# EAGLE schematic Schematic (EAGLE 7.7.0)
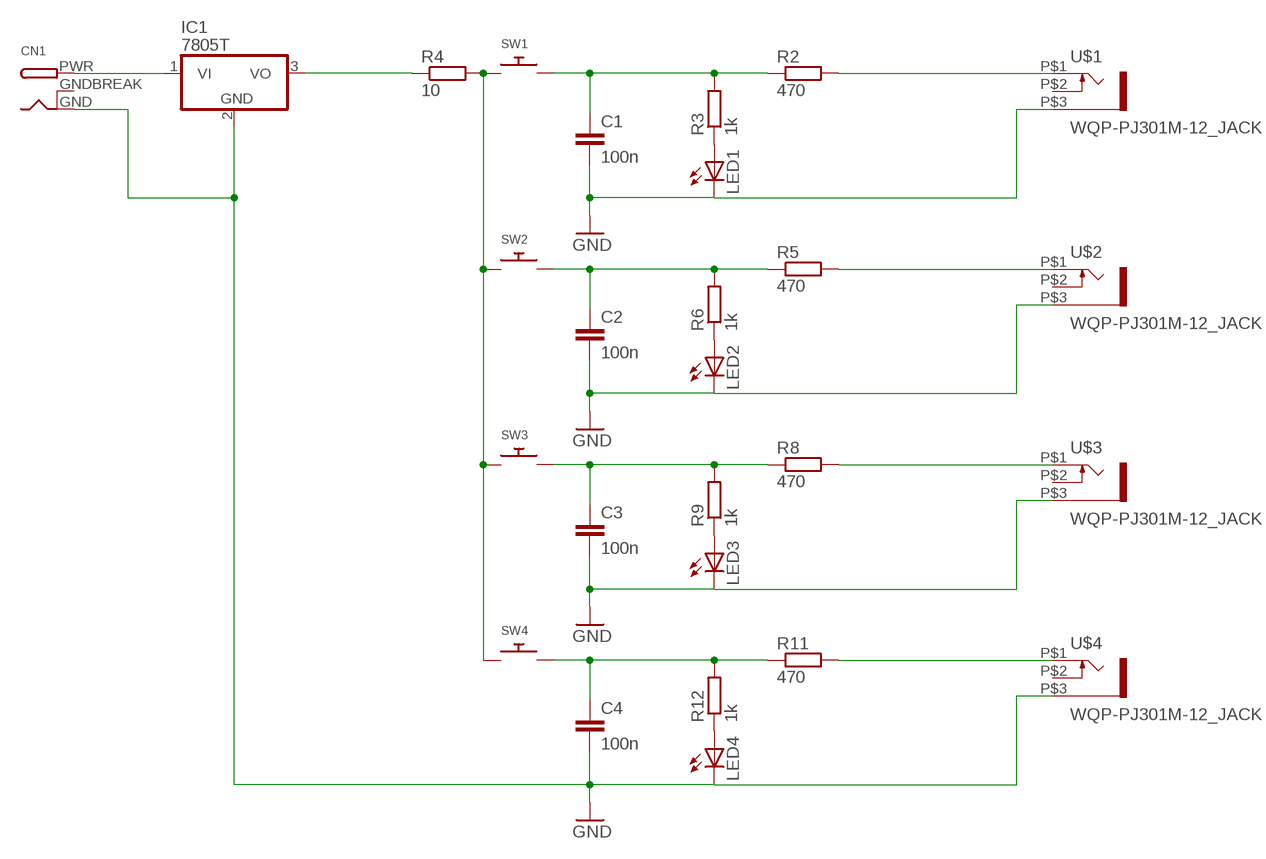
[diagram p0: schematic, sheet 1]

## Parts
C1  100n  C-EU025-025X050  [C025-025X050]
C2  100n  C-EU025-025X050  [C025-025X050]
C3  100n  C-EU025-025X050  [C025-025X050]
C4  100n  C-EU025-025X050  [C025-025X050]
CN1  DCBARRELPTH  [DCJACK_2MM_PTH]
IC1  7805T  [TO220H]
LED1  LED5MM  [LED5MM]
LED2  LED5MM  [LED5MM]
LED3  LED5MM  [LED5MM]
LED4  LED5MM  [LED5MM]
R2  470  R-EU_0204/7  [0204/7]
R3  1k  R-EU_0204/7  [0204/7]
R4  10  R-EU_0204/7  [0204/7]
R5  470  R-EU_0204/7  [0204/7]
R6  1k  R-EU_0204/7  [0204/7]
R8  470  R-EU_0204/7  [0204/7]
R9  1k  R-EU_0204/7  [0204/7]
R11  470  R-EU_0204/7  [0204/7]
R12  1k  R-EU_0204/7  [0204/7]
SW1  SWITCH_PUSHBUTTONEVQ-PE  [TACT_PANA-EVQ]
SW2  SWITCH_PUSHBUTTONEVQ-PE  [TACT_PANA-EVQ]
SW3  SWITCH_PUSHBUTTONEVQ-PE  [TACT_PANA-EVQ]
SW4  SWITCH_PUSHBUTTONEVQ-PE  [TACT_PANA-EVQ]
U$1  WQP-PJ301M-12_JACK  [WQP-PJ301M-12_JACK]
U$2  WQP-PJ301M-12_JACK  [WQP-PJ301M-12_JACK]
U$3  WQP-PJ301M-12_JACK  [WQP-PJ301M-12_JACK]
U$4  WQP-PJ301M-12_JACK  [WQP-PJ301M-12_JACK]

## Nets
GND: C1.2 C2.2 C3.2 C4.2 CN1.GND IC1.2(GND) LED1.K(C) LED2.K(C) LED3.K(C) LED4.K(C) U$1.P$3 U$2.P$3 U$3.P$3 U$4.P$3
N$1: LED1.A R3.1
N$2: IC1.3(VO) R4.1
N$3: C1.1 R2.1 R3.2 SW1.P$2
N$4: R4.2 SW1.P$1 SW2.P$1 SW3.P$1 SW4.P$1
N$5: R2.2 U$1.P$1
N$6: CN1.PWR IC1.1(VI)
N$9: C2.1 R5.1 R6.2 SW2.P$2
N$10: R5.2 U$2.P$1
N$11: LED2.A R6.1
N$13: C3.1 R8.1 R9.2 SW3.P$2
N$14: R8.2 U$3.P$1
N$15: LED3.A R9.1
N$17: C4.1 R11.1 R12.2 SW4.P$2
N$18: R11.2 U$4.P$1
N$19: LED4.A R12.1
Unconnected: U$1.P$2 U$2.P$2 U$3.P$2 U$4.P$2

## Power pins joined to a net without a drawn wire
GNDBREAK: CN1.GNDBREAK

## Library data of the parts
C1-C4 = resistor:C-EU: CAPACITOR, European symbol
CN1 = adafruit:DCBARREL: 2.0mm DC Barrel Jack DCJACK_2MM_PTH - Through Hole Jack (4UConnector: 05537)
IC1 = linear:78*: Positive VOLTAGE REGULATOR Source: http://cache.national.com/ds/LM/LM78L05.pdf http://www.fairchildsemi.com/ds/LM/LM7805.pdf
LED1-LED4 = adafruit:LED: LED OSRAM: - CHIPLED LG R971, LG N971, LY N971, LG Q971, LY Q971, LO R971, LY R971 LH N974, LH R974 LS Q976, LO Q976, LY Q976 LO Q996 - Hyper CHIPLED LW Q18S LB Q993, LB Q99A, LB R99A - SideLED LS A670, LO A670, LY A670, LG A670, LP A670 LB A673, LV A673, LT A673, LW A673 LH A674 LY A675 LS A676, LA A676, LO A676, LY A676, LW A676 LS A679, LY A679, LG A679 - Hyper Micro SIDELED® LS Y876, LA Y876, LO Y876, LY Y876 LT Y87S - SmartLED LW L88C, LW L88S LB L89C, LB L89S, LG L890 LS L89K, LO L89K, LY L89K LS L896, LA L896, LO L896, LY L896 - TOPLED LS T670, LO T670, LY T670, LG T670, LP T670 LSG T670, LSP T670, LSY T670, LOP T670, LYG T670 LG T671, LOG T671, LSG T671 LB T673, LV T673, LT T673, LW T673 LH T674 LS T676, LA T676, LO T676, LY T676, LB T676, LH T676, LSB T676, LW T676 LB T67C, LV T67C, LT T67C, LS T67K, LO T67K, LY T67K, LW E67C LS E67B, LA E67B, LO E67B, LY E67B, LB E67C, LV E67C, LT E67C LW T67C LS T679, LY T679, LG T679 LS T770, LO T770, LY T770, LG T770, LP T770 LB T773, LV T773, LT T773, LW T773 LH T774 LS E675, LA E675, LY E675, LS T675 LS T776, LA T776, LO T776, LY T776, LB T776 LHGB T686 LT T68C, LB T68C - Hyper Mini TOPLED® LB M676 - Mini TOPLED Santana® LG M470 LS M47K, LO M47K, LY M47K Source: http://www.osram.convergy.de/
R2-R6 R8 R9 R11 R12 = resistor:R-EU_: RESISTOR, European symbol
SW1-SW4 = adafruit:SWITCH_PUSHBUTTON: Buttons SOFTTOUCHSMD_SJ - Soft touch temporary push button (Super Junk Akihabara) Compatible with SKPMANE010 [Mouser: 688-SKPMAN] C&K_KSS = Digikey: KSS221GLFS
U$1-U$4 = EnricoMostUsed:WQP-PJ301M-12_JACK